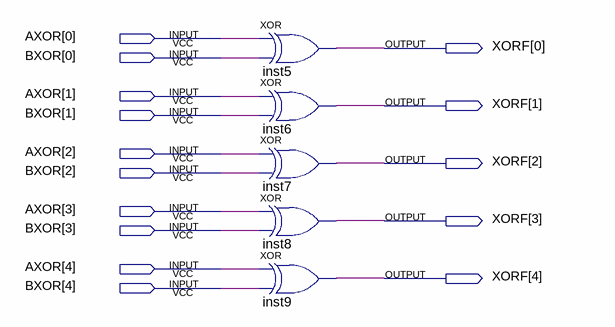
[diagram p0: schematic sheet]
// Quartus schematic AXORB.bdf as structural Verilog: 5 symbols, 15 pins
module AXORB (
  input  [4:0] AXOR,
  input  [4:0] BXOR,
  output [4:0] XORF
);

  xor inst5 (XORF[0], AXOR[0], BXOR[0]);
  xor inst6 (XORF[1], AXOR[1], BXOR[1]);
  xor inst7 (XORF[2], AXOR[2], BXOR[2]);
  xor inst8 (XORF[3], AXOR[3], BXOR[3]);
  xor inst9 (XORF[4], AXOR[4], BXOR[4]);
endmodule
